# Altium schematic sheet Принц. схема.SchDoc
size 364 x 320 mm
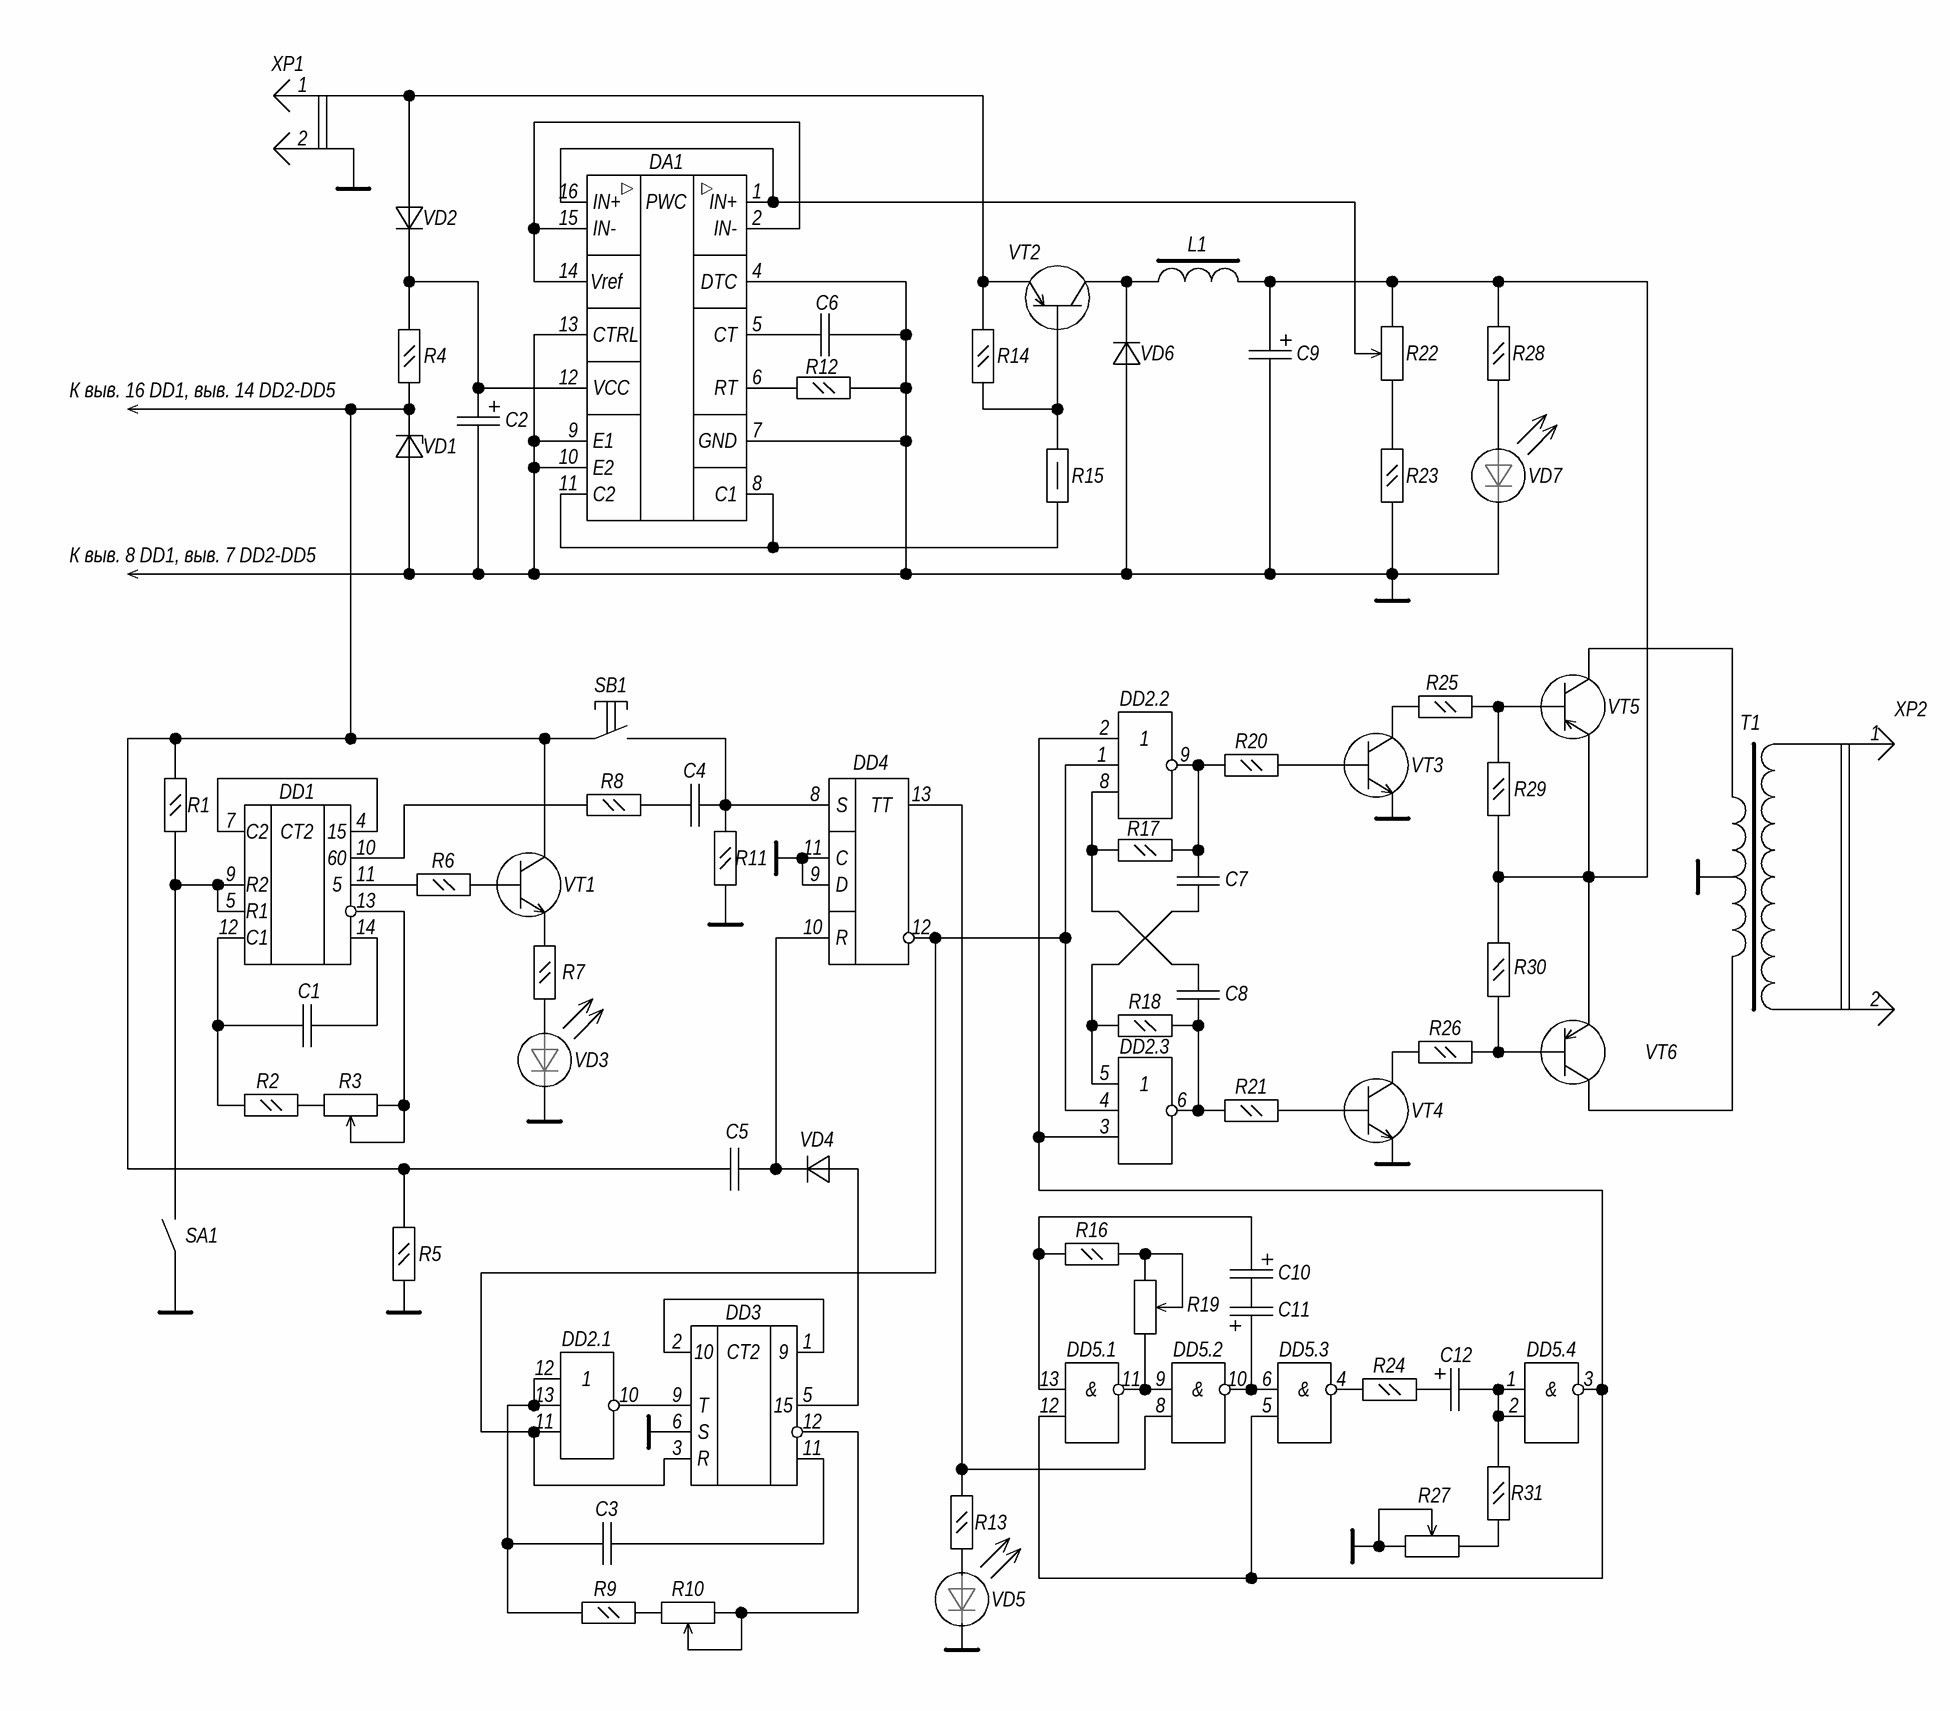
[diagram p0: Принц. схема.SchDoc]

## Notes on the sheet
- XP1
- 1
- 2
- DA1
- VD2
- 16
- 15
- IN+
- IN-
- PWC
- VT2
- L1
- 14
- Vref
- DTC
- 4
- C6
- R4
- 13
- 12
- CTRL
- VCC
- CT
- RT
- 6
- 5
- R12
- R14
- VD6
- C9
- R22
- R28
- К выв. 16 DD1, выв. 14 DD2-DD5
- VD1
- C2
- 9
- 10
- E1
- GND
- 7
- 11
- E2
- C1
- 8
- R15
- R23
- VD7
- К выв. 8 DD1, выв. 7 DD2-DD5
- SB1
- DD2.2
- R25
- VT5
- T1
- XP2
- DD1
- R8
- C4
- DD4
- R20
- VT3
- R29
- R1
- CT2
- 60
- R6
- R11
- S
- C
- TT
- R17
- R2
- VT1
- D
- C7
- R7
- R
- C8
- R30
- VD3
- DD2.3
- R18
- R26
- VT6
- R3
- C5
- 3
- R21
- VT4
- VD4
- SA1
- R5
- R16
- DD3
- R19
- C10
- C11
- DD2.1
- &
- DD5.1
- DD5.2
- DD5.3
- R24
- C12
- DD5.4
- T
- C3
- R13
- R27
- R31
- R9
- R10
- VD5